# Altium schematic sheet MainBoard_V1p0_MAIN.SchDoc
size A4; SheetNumber: 1; SheetTotal: 8
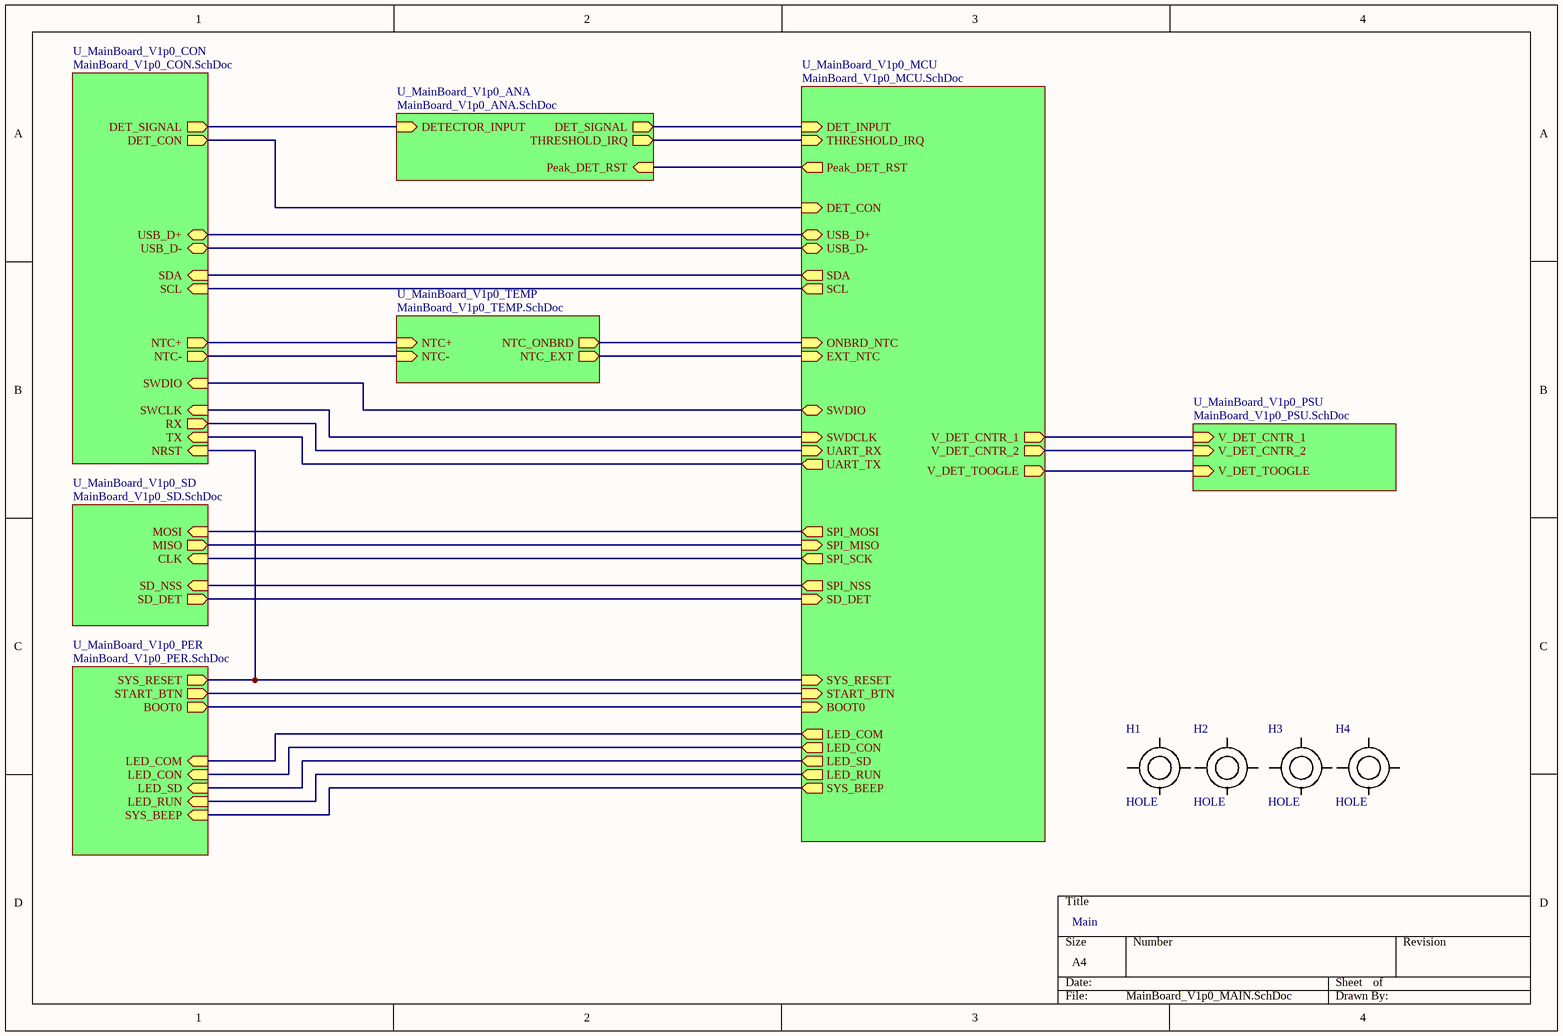
[diagram p0: MainBoard_V1p0_MAIN.SchDoc]

## Parts
H1  HOLE  [HOLE_140_160MIL]
H2  HOLE  [HOLE_140_160MIL]
H3  HOLE  [HOLE_140_160MIL]
H4  HOLE  [HOLE_140_160MIL]

## Sub-sheets
U_MainBoard_V1p0_ANA = MainBoard_V1p0_ANA.SchDoc: DETECTOR_INPUT (in), DET_SIGNAL (out), Peak_DET_RST (in), THRESHOLD_IRQ (out)
U_MainBoard_V1p0_CON = MainBoard_V1p0_CON.SchDoc: USB_D- (bidir), USB_D+ (bidir), DET_SIGNAL (out), NTC+ (out), NTC- (out), SCL (in), SDA (in), DET_CON (out), RX (out), SWCLK (in), SWDIO (in), NRST (in), TX (in)
U_MainBoard_V1p0_MCU = MainBoard_V1p0_MCU.SchDoc: SPI_NSS (out), SPI_SCK (out), SPI_MISO (in), SPI_MOSI (out), SCL (out), SDA (out), DET_INPUT (in), ONBRD_NTC (in), EXT_NTC (in), THRESHOLD_IRQ (in), SYS_RESET (in), START_BTN (in), SYS_BEEP (out), LED_COM (out), LED_CON (out), LED_SD (out), LED_RUN (out), UART_TX (out), UART_RX (in), USB_D- (bidir), USB_D+ (bidir), SWDIO (bidir), SWDCLK (in), Peak_DET_RST (out), V_DET_CNTR_1 (out), V_DET_CNTR_2 (out), BOOT0 (in), DET_CON (in), SD_DET (in), V_DET_TOOGLE (out)
U_MainBoard_V1p0_PER = MainBoard_V1p0_PER.SchDoc: LED_COM (in), LED_CON (in), LED_SD (in), LED_RUN (in), SYS_BEEP (in), SYS_RESET (out), START_BTN (out), BOOT0 (out)
U_MainBoard_V1p0_PSU = MainBoard_V1p0_PSU.SchDoc: V_DET_CNTR_1 (in), V_DET_CNTR_2 (in), V_DET_TOOGLE (in)
U_MainBoard_V1p0_SD = MainBoard_V1p0_SD.SchDoc: SD_DET (out), SD_NSS (in), MOSI (in), CLK (in), MISO (out)
U_MainBoard_V1p0_TEMP = MainBoard_V1p0_TEMP.SchDoc: NTC+ (in), NTC- (in), NTC_ONBRD (out), NTC_EXT (out)

## Nets
(unnamed): sheet U_MainBoard_V1p0_ANA/DETECTOR_INPUT, sheet U_MainBoard_V1p0_CON/DET_SIGNAL
(unnamed): sheet U_MainBoard_V1p0_ANA/DET_SIGNAL, sheet U_MainBoard_V1p0_MCU/DET_INPUT
(unnamed): sheet U_MainBoard_V1p0_ANA/Peak_DET_RST, sheet U_MainBoard_V1p0_MCU/Peak_DET_RST
(unnamed): sheet U_MainBoard_V1p0_ANA/THRESHOLD_IRQ, sheet U_MainBoard_V1p0_MCU/THRESHOLD_IRQ
(unnamed): sheet U_MainBoard_V1p0_CON/USB_D-, sheet U_MainBoard_V1p0_MCU/USB_D-
(unnamed): sheet U_MainBoard_V1p0_CON/USB_D+, sheet U_MainBoard_V1p0_MCU/USB_D+
(unnamed): sheet U_MainBoard_V1p0_CON/NTC+, sheet U_MainBoard_V1p0_TEMP/NTC+
(unnamed): sheet U_MainBoard_V1p0_CON/NTC-, sheet U_MainBoard_V1p0_TEMP/NTC-
(unnamed): sheet U_MainBoard_V1p0_CON/SCL, sheet U_MainBoard_V1p0_MCU/SCL
(unnamed): sheet U_MainBoard_V1p0_CON/SDA, sheet U_MainBoard_V1p0_MCU/SDA
(unnamed): sheet U_MainBoard_V1p0_CON/DET_CON, sheet U_MainBoard_V1p0_MCU/DET_CON
(unnamed): sheet U_MainBoard_V1p0_CON/RX, sheet U_MainBoard_V1p0_MCU/UART_RX
(unnamed): sheet U_MainBoard_V1p0_CON/SWCLK, sheet U_MainBoard_V1p0_MCU/SWDCLK
(unnamed): sheet U_MainBoard_V1p0_CON/SWDIO, sheet U_MainBoard_V1p0_MCU/SWDIO
(unnamed): sheet U_MainBoard_V1p0_CON/NRST, sheet U_MainBoard_V1p0_MCU/SYS_RESET, sheet U_MainBoard_V1p0_PER/SYS_RESET
(unnamed): sheet U_MainBoard_V1p0_CON/TX, sheet U_MainBoard_V1p0_MCU/UART_TX
(unnamed): sheet U_MainBoard_V1p0_MCU/SPI_NSS, sheet U_MainBoard_V1p0_SD/SD_NSS
(unnamed): sheet U_MainBoard_V1p0_MCU/SPI_SCK, sheet U_MainBoard_V1p0_SD/CLK
(unnamed): sheet U_MainBoard_V1p0_MCU/SPI_MISO, sheet U_MainBoard_V1p0_SD/MISO
(unnamed): sheet U_MainBoard_V1p0_MCU/SPI_MOSI, sheet U_MainBoard_V1p0_SD/MOSI
(unnamed): sheet U_MainBoard_V1p0_MCU/ONBRD_NTC, sheet U_MainBoard_V1p0_TEMP/NTC_ONBRD
(unnamed): sheet U_MainBoard_V1p0_MCU/EXT_NTC, sheet U_MainBoard_V1p0_TEMP/NTC_EXT
(unnamed): sheet U_MainBoard_V1p0_MCU/START_BTN, sheet U_MainBoard_V1p0_PER/START_BTN
(unnamed): sheet U_MainBoard_V1p0_MCU/SYS_BEEP, sheet U_MainBoard_V1p0_PER/SYS_BEEP
(unnamed): sheet U_MainBoard_V1p0_MCU/LED_COM, sheet U_MainBoard_V1p0_PER/LED_COM
(unnamed): sheet U_MainBoard_V1p0_MCU/LED_CON, sheet U_MainBoard_V1p0_PER/LED_CON
(unnamed): sheet U_MainBoard_V1p0_MCU/LED_SD, sheet U_MainBoard_V1p0_PER/LED_SD
(unnamed): sheet U_MainBoard_V1p0_MCU/LED_RUN, sheet U_MainBoard_V1p0_PER/LED_RUN
(unnamed): sheet U_MainBoard_V1p0_MCU/V_DET_CNTR_1, sheet U_MainBoard_V1p0_PSU/V_DET_CNTR_1
(unnamed): sheet U_MainBoard_V1p0_MCU/V_DET_CNTR_2, sheet U_MainBoard_V1p0_PSU/V_DET_CNTR_2
(unnamed): sheet U_MainBoard_V1p0_MCU/BOOT0, sheet U_MainBoard_V1p0_PER/BOOT0
(unnamed): sheet U_MainBoard_V1p0_MCU/SD_DET, sheet U_MainBoard_V1p0_SD/SD_DET
(unnamed): sheet U_MainBoard_V1p0_MCU/V_DET_TOOGLE, sheet U_MainBoard_V1p0_PSU/V_DET_TOOGLE

## Notes on the sheet
- Main